# Altium schematic sheet 12 CONSOLE.SchDoc
size A4; SheetNumber: 7; SheetTotal: 9
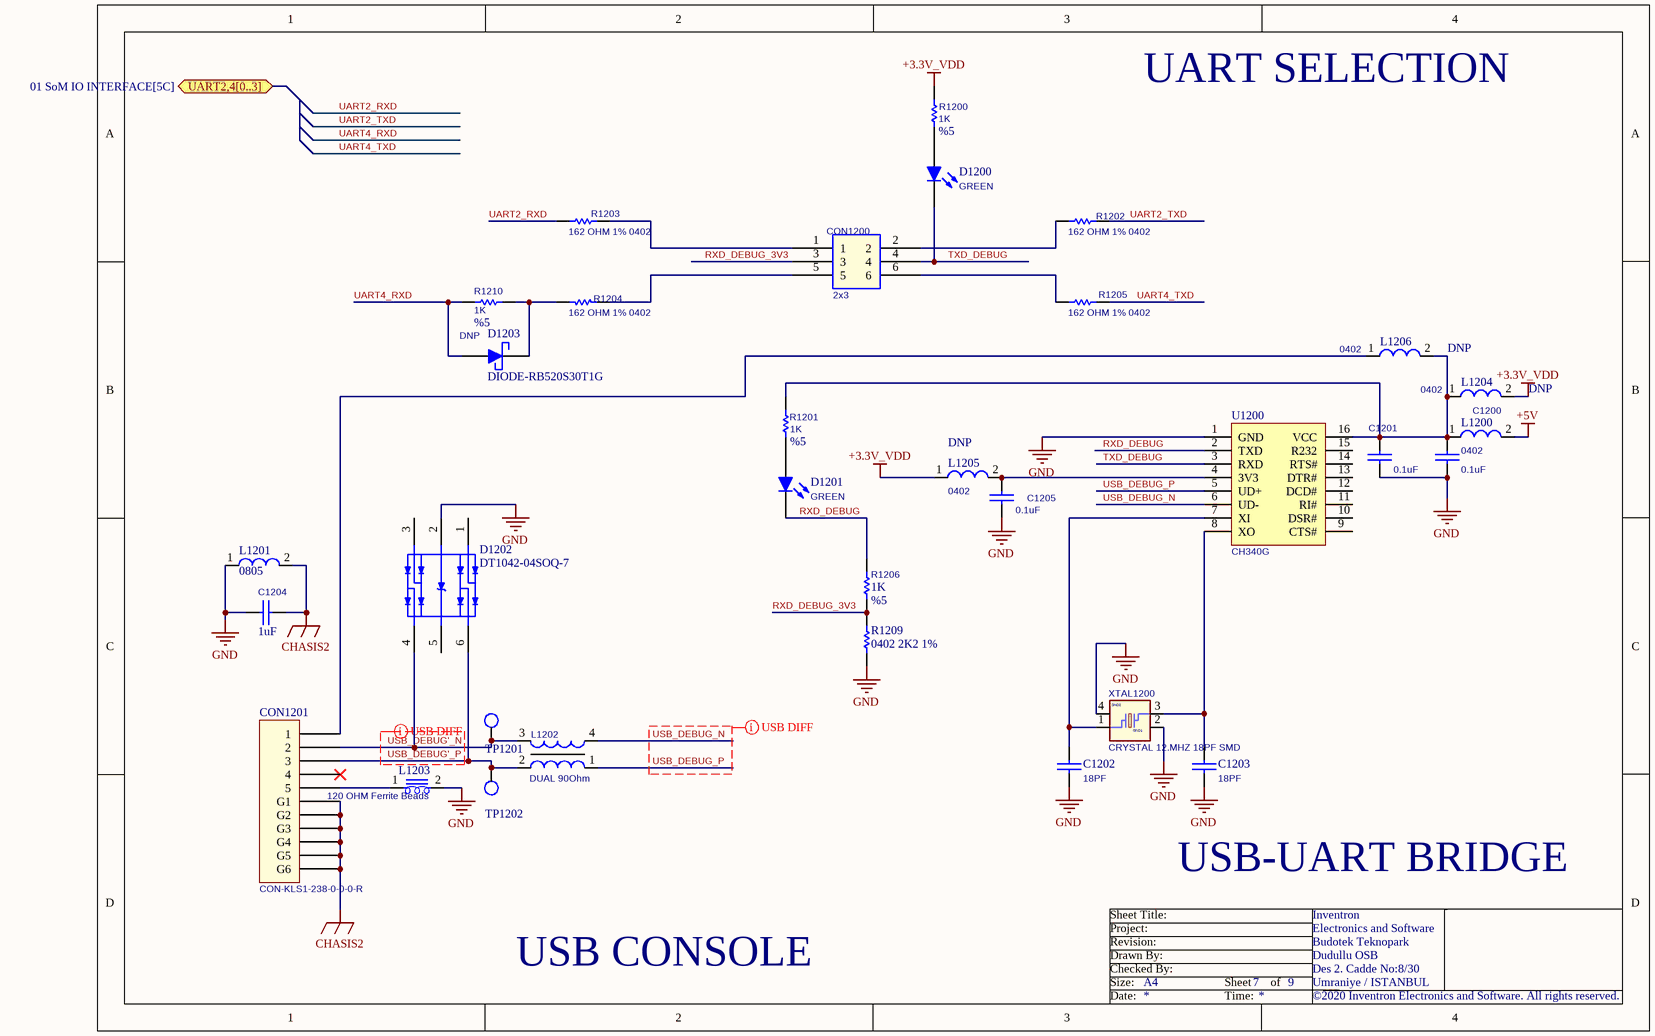
[diagram p0: 12 CONSOLE.SchDoc]

## Parts
C1200  0.1uF  [0402_CC]
C1201  0.1uF  [0402_CC]
C1202  18PF  [0402_CC]
C1203  18PF  [0402_CC]
C1204  1uF  [0603_CC]
C1205  0.1uF  [0402_CC]
CON1200  2x3  [HEADER 2.54 X 3x2]
CON1201  CON-KLS1-238-0-0-0-R  [KLS1-238-0-0-0-R]
D1200  GREEN  [0603_LED]
D1201  GREEN  [0603_LED]
D1202  DT1042-04SOQ-7  [DIODE-DT1042-04SOQ-7]
D1203  DIODE-RB520S30T1G  [SOD523]
L1200  0402  [0402_RES]
L1201  0805  [0805]
L1202  DUAL 90Ohm  [DLW21H]
L1203  120 OHM Ferrite Beads  [0603_RES]
L1204  0402  ASSY_OPT: DNP  [0402_RES]  (no BOM)
L1205  0402  ASSY_OPT: DNP  [0402_RES]  (no BOM)
L1206  0402  ASSY_OPT: DNP  [0402_RES]  (no BOM)
R1200  1K  Tolerance: %5  [0402_RES]
R1201  1K  Tolerance: %5  [0402_RES]
R1202  162 OHM 1% 0402  [0402_RES]
R1203  162 OHM 1% 0402  [0402_RES]
R1204  162 OHM 1% 0402  [0402_RES]
R1205  162 OHM 1% 0402  [0402_RES]
R1206  1K  Tolerance: %5  [0402_RES]
R1209  0402 2K2 1%  [0402_RES]
R1210  1K  ASSY_OPT: DNP  Tolerance: %5  [0402_RES]  (no BOM)
TP1201  TEST POINT 15  [testpoint_15]  (value not drawn)  (no BOM)
TP1202  TEST POINT 15  [testpoint_15]  (value not drawn)  (no BOM)
U1200  CH340G  [CH340G]
XTAL1200  CRYSTAL 12.MHZ 18PF SMD  [XTLOSC4_3P2X2P5MM_SM]

## Ports
UART2,4[0..3] (bidir, see 01 SoM IO INTERFACE[5C])

## Nets
+3.3V_VDD: L1204.2 L1205.1 R1200.1
+5V: L1200.2
CHASIS2: C1204.1 CON1201.G1 CON1201.G2 CON1201.G3 CON1201.G4 CON1201.G5 CON1201.G6 L1201.2
GND: C1200.2 C1201.2 C1202.2 C1203.2 C1204.2 C1205.2 D1202.2(VSS) L1201.1 L1203.2 R1209.1 U1200.1(GND) XTAL1200.2(GND1) XTAL1200.4(GND2)
RXD_DEBUG: D1201.2(K) R1206.2 U1200.2(TXD)
RXD_DEBUG_3V3: CON1200.3 R1206.1 R1209.2
TXD_DEBUG: CON1200.4 D1200.2(K) U1200.3(RXD)
UART2_RXD: R1203.1
UART2_TXD: R1202.2
UART4_RXD: D1203.1(A) R1210.1
UART4_TXD: R1205.2
USB_DEBUG'_N: CON1201.2 D1202.4(IO3) L1202.3 TP1201.1
USB_DEBUG'_P: CON1201.3 D1202.6(IO4) L1202.2 TP1202.1
USB_DEBUG_N: L1202.4 U1200.6(UD-)
USB_DEBUG_P: L1202.1 U1200.5(UD+)
NetC1200_1: C1200.1 C1201.1 L1200.1 L1204.1 L1206.2 R1201.1 U1200.16(VCC)
NetC1202_1: C1202.1 U1200.7(XI) XTAL1200.1
NetC1203_1: C1203.1 U1200.8(XO) XTAL1200.3
NetC1205_1: C1205.1 L1205.2 U1200.4(3V3)
NetCON1200_1: CON1200.1 R1203.2
NetCON1200_2: CON1200.2 R1202.1
NetCON1200_5: CON1200.5 R1204.2
NetCON1200_6: CON1200.6 R1205.1
NetCON1201_1: CON1201.1 L1206.1
NetCON1201_5: CON1201.5 L1203.1
NetD1200_1: D1200.1(A) R1200.2
NetD1201_1: D1201.1(A) R1201.2
NetD1203_2: D1203.2(K) R1204.1 R1210.2

Not connected (* = marked no-connect by the designer): CON1201 4*; D1202 1(IO1) 3(IO2) 5(VCC); U1200 9(CTS#) 10(DSR#) 11(RI#) 12(DCD#) 13(DTR#) 14(RTS#) 15(R232)

## Layout directives
differential pair; differential pair class USB 90 OHM DIFF: USB_DEBUG'_N, USB_DEBUG'_P, USB_DEBUG_N, USB_DEBUG_P

## Notes on the sheet
- UART SELECTION
- USB-UART BRIDGE
- USB CONSOLE
- Sheet Title:
- Inventron
- Size:
- Drawn By:
- Revision:
- Project:
- Checked By:
- A4
- Sheet
- of
- Budotek Teknopark
- Dudullu OSB
- Des 2. Cadde No:8/30
- Umraniye / ISTANBUL
- Electronics and Software
- Date:
- Time:
- ©2020 Inventron Electronics and Software. All rights reserved.

## Library data of the parts
C1200 C1201 C1205 = CAP-CL05B104KO5NNNC: CAP VER 0.1UF 16V X7R 0402; Manufacturer-1: SAMSUNG; Opt. Temp.: -55/+125; Class: Capacitor; Manufacturer Part Number-1: CL05B104KO5NNNC; Footprint: 0402; Manufacturer-2: *; Manufacturer Part Number-2: *; Inventron Stock No: *; Created By: LA; Created Date: 23.11.2018; Checked By: *; ASSY_OPT: *; Dimensions: *; Unit Price: 0,00499; Revision Date/Note: *; Price Break: 10K
C1202 C1203 = CAP-GCM1555C1H180JA16D: CAP CER 18PF 50V C0G/NP0 0402; Manufacturer-1: Murata Electronics; Class: Capacitor; Manufacturer Part Number-1: GCM1555C1H180JA16D; Footprint: *; Manufacturer-2: *; Manufacturer Part Number-2: *; Inventron Stock No: *; Created By: *; Created Date: *; Checked By: *; ASSY_OPT: *; Dimensions: *; Unit Price: *; Revision Date/Note: *; Price Break: *; Opt. Temp.: *; Features: *
C1204 = CAP-CL10B105KA8NNNC: CAP CER 1UF 25V X7R 0603; Manufacturer-1: SAMSUNG; Class: Capacitor; Manufacturer Part Number-1: CL10B105KA8NNNC; Footprint: *; Manufacturer-2: *; Manufacturer Part Number-2: *; Inventron Stock No: *; Created By: LA; Created Date: *; Checked By: *; ASSY_OPT: *; Dimensions: *; Unit Price: *; Revision Date/Note: *; Price Break: *; Opt. Temp.: *; Features: *
CON1200 = CON-6 PIN 2.54MM: 2x3 6 PIN 2.54MM HEADER; Class: Connector; Manufacturer Part Number-1: *; Footprint: *; Manufacturer-1: *; Manufacturer-2: *; Manufacturer Part Number-2: *; Inventron Stock No: *; Created By: *; Created Date: *; Checked By: *; ASSY_OPT: *; Dimensions: *; Unit Price: *; Revision Date/Note: *; Price Break: *; Opt. Temp.: *
CON1201 = CON-KLS1-238-0-0-0-R: Manufacturer-1: KLS; Class: Connector; Manufacturer Part Number-1: KLS1-238-0-0-0-R; Footprint: *; Manufacturer-2: *; Manufacturer Part Number-2: *; Inventron Stock No: *; Created By: OKS,EE; Created Date: *; Checked By: *; ASSY_OPT: *; Dimensions: *; Unit Price: 0.085,0.078; Revision Date/Note: *; Price Break: 1000,5000; Opt. Temp.: *; Features: *
D1200 D1201 = LED-LTST-C190KRKT: LED SMD 0603 SUPER GREEN; Manufacturer-1: LITEON; Manufacturer Part Number-1: LTST-C190KRKT; Footprint: *; Manufacturer-2: *; Manufacturer Part Number-2: *; Inventron Stock No: *; Created By: *; Created Date: *; Checked By: *; ASSY_OPT: *; Dimensions: *; Unit Price: 0.03343; Revision Date/Note: *; Price Break: 4000; Opt. Temp.: *; Class: Led; Features: *
D1202 = DIODE-DT1042-04SOQ-7: HDMI TVS DIODE; Manufacturer-1: Diodes Incorporated; Opt. Temp.: -55°C ~ 85°C (TA); Manufacturer Part Number-1: DT1042-04SOQ-7; Footprint: SOT26; Manufacturer-2: *; Manufacturer Part Number-2: *; Inventron Stock No: *; Created By: E.E; Created Date: 23.10.2020; Checked By: *; ASSY_OPT: *; Dimensions: *; Unit Price: 0.07575; Revision Date/Note: *; Price Break: 3000; Class: Diode
D1203 = DIODE-RB520S30T1G: DIODE SCHOTTKY 30V 200MA SOD523; Manufacturer-1: ON SEMI; Opt. Temp.: -55/+150; Manufacturer Part Number-1: RB520S30T1G; Footprint: SOD-523; Manufacturer-2: *; Manufacturer Part Number-2: *; Inventron Stock No: *; Created By: LA; Created Date: 23.11.2018; Checked By: *; ASSY_OPT: *; Dimensions: *; Unit Price: 0,0324; Revision Date/Note: *; Price Break: 3K; Class: Diode
L1200 L1204-L1206 = IND-FERRITE (RES 0 OHM) 0402: 0OHM 0402; Manufacturer Part Number-1: RMCF0402ZT0R00; Manufacturer-1: Stackpole Electronics Inc; Class: Inductor; Footprint: 0402; Manufacturer-2: *; Inventron Stock No: *; Created By: EE; Checked By: *; Dimensions: *; Unit Price: 0.00186; Revision Date/Note: *; Price Break: 1000
  L1200: ASSY_OPT: *
L1201 = IND-FERRITE (RES 0 OHM) 0805: 0OHM 0805; Manufacturer Part Number-1: AC0805JR-070RL; Manufacturer-1: YAGEO; Class: Inductor; Manufacturer-2: *; Inventron Stock No: *; Created By: EE; Checked By: *; ASSY_OPT: *; Dimensions: *; Revision Date/Note: *
L1202 = IND-DLW21HN900SQ2L: Common Mode Chokes Dual 90Ohm 100MHz 0.33A 0.35Ohm DCR SMD T/R; Manufacturer-1: Murata Manufacturing; Class: Inductor; Manufacturer Part Number-1: DLW21HN900SQ2L; Footprint: *; Manufacturer-2: *; Manufacturer Part Number-2: *; Inventron Stock No: *; Created By: E.E; Created Date: 2.11.2020; Checked By: *; ASSY_OPT: *; Dimensions: *; Unit Price: 0.185; Revision Date/Note: *; Price Break: 3000; Opt. Temp.: *; Features: *
L1203 = IND-BLM18PG121SH1D: Ferrite Beads Multi-Layer 120Ohm 25% 100MHz 2A 0.05Ohm DCR 0603 Automotive T/R; Manufacturer-1: Murata Manufacturing; Class: Inductor; Manufacturer Part Number-1: BLM18PG121SH1D; Footprint: 0603; Manufacturer-2: *; Manufacturer Part Number-2: *; Inventron Stock No: *; Created By: E.E; Created Date: 2.11.2020; Checked By: *; ASSY_OPT: *; Dimensions: *; Unit Price: 0.02550; Revision Date/Note: *; Price Break: 4000; Opt. Temp.: *; Features: *
R1200 R1201 R1206 R1210 = RES-RMCF0402JT1K00: RES 1K OHM 5% 1/16W 0402; Manufacturer-1: STACKPOLE; Opt. Temp.: -55/+155; Class: Resistor; Manufacturer Part Number-1: RMCF0402JT1K00; Footprint: 0402; Manufacturer-2: *; Manufacturer Part Number-2: *; Inventron Stock No: *; Created By: LA; Created Date: 23.11.2018; Checked By: *; Dimensions: *; Unit Price: 0,00127; Revision Date/Note: *; Price Break: 10K
  R1200 R1201 R1206: ASSY_OPT: *
R1202-R1205 = RES-ERJ-2RKF1620X: 162 ±1% 0.1W, 1/10W Chip Resistor 0402 (1005 Metric) Automotive AEC-Q200 Thick Film; Manufacturer-1: Panasonic Electronic Components; Manufacturer Part Number-1: ERJ-2RKF1620X; Footprint: 0402; Manufacturer-2: *; Manufacturer Part Number-2: *; Inventron Stock No: *; Created By: E.E; Created Date: 8.11.2020; Checked By: *; ASSY_OPT: *; Dimensions: *; Unit Price: *; Revision Date/Note: *; Price Break: *; Opt. Temp.: *; Class: Resistor; Tolerance: *
R1209 = RES-CRGCQ0402F2K2: 2.2 ±1% 0.063W, 1/16W Chip Resistor 0402 (1005 Metric) Automotive AEC-Q200, Moisture Resistant Thick Film; Manufacturer-1: TE Connectivity Passive Product; Opt. Temp.: -55°C ~ 155°C; Manufacturer Part Number-1: CRGCQ0402F2K2; Footprint: 0402; Manufacturer-2: *; Manufacturer Part Number-2: *; Inventron Stock No: *; Created By: E.E; Created Date: 22.10.2020; Checked By: *; ASSY_OPT: *; Dimensions: *; Unit Price: *; Revision Date/Note: *; Price Break: *; Class: Resistor; Tolerance: *
U1200 = IC-CH340G: IC-340 USB INTERFACE SO16; Manufacturer-1: ÖZDİSAN; Class: ICs; Manufacturer Part Number-1: CH340G; Footprint: S016; Manufacturer-2: *; Manufacturer Part Number-2: *; Inventron Stock No: *; Created By: E.E.; Created Date: 16.10.2020; Checked By: *; ASSY_OPT: *; Dimensions: *; Unit Price: 0.35; Revision Date/Note: *; Price Break: 5000; Opt. Temp.: *
XTAL1200 = XTAL-FA-238V 12.0000MB50X-C0: CRYSTAL 12.0000MHZ 18PF SMD; Manufacturer-1: EPSON; Opt. Temp.: +40/+85; Manufacturer Part Number-1: FA-238V 12.0000MB50X-C0; Footprint: 4-SMD; Manufacturer-2: *; Manufacturer Part Number-2: *; Inventron Stock No: *; Created By: E.E; Created Date: 20.10.2020; Checked By: *; ASSY_OPT: *; Dimensions: *; Unit Price: 0.6; Revision Date/Note: *; Price Break: 1K; Class: Crystal